# Altium schematic sheet Sheet1asc2.SchDoc
size 594 x 420 mm; SheetNumber: 1; SheetTotal: 1; SPICEModelCacheQNQMALTS: <root>  <DocumentId>QNQMALTS</DocumentId>  <CacheFrame Number="0">    <Model Name="spdtrelay" Kind="CKT">      <Text>*Generic SPDT Relay*Connections:     COM *                 | NC*                 | | NO*                 | | | T1*                 | | | | T2*                 | | | | |.SUBCKT SPDTRELAY 1 2 3 4 5 + PARAMS: PULLIN=4 DROPOFF=0.1 CONTACT=1m RESISTANCE=500 INDUCTANCE=10mL1 4 6 {(INDUCTANCE/2)}L2 5 7 {(INDUCTANCE/2)}R1 6 7 {RESISTANCE}BNO 8 0 V={PULLIN}-abs(v(6,7))SW1 2 1 8 0 SWNC ONBNC 9 0 V=abs(v(6,7))SW2 3 1 9 0 SWNO OFF.MODEL SWNC SW(VT={DROPOFF} RON={CONTACT} ).MODEL SWNO SW(VT={(PULLIN*0.98)} RON={CONTACT} ).ENDS SPDTRELAY</Text>    </Model>    <Model Name="dpstrelay" Kind="CKT">      <Text>*DPST Relay Subcircuit Parameters*PULLIN     = Pull in voltage*DROPOFF    = Drop off voltage*CONTACT    = Contact resistance*RESISTANCE = Coil resistance*INDUCTANCE = Coil Inductance * jjt 15/6/2002: changed DPDT model to DPST.**Generic DPST Relay*Connections:     NO_A1*                 | NO_A2*                 | | NO_B1*                 | | | NO_B2*                 | | | |  T1*                 | | | |  | T2*                 | | | |  | |*                 | | | |  | |*                 | | | |  | |*                 | | | |  | |.SUBCKT DPSTRELAY 1 2 3 10 4 5+ PARAMS: PULLIN=4 DROPOFF=0.1 CONTACT=1m RESISTANCE=500 INDUCTANCE=10mL1 4 6 {(INDUCTANCE/2)}L2 5 7 {(INDUCTANCE/2)}R1 6 7 {RESISTANCE}*BNO1 8 0 V={PULLIN}-abs(v(6,7))SW1 1 2 8 0 SWNO OFF*BNO2 9 0 V={PULLIN}-abs(v(6,7))SW2 3 10 9 0 SWNO OFF*.MODEL SWNO SW(VT={(PULLIN*0.98)} RON={CONTACT} ).ENDS DPSTRELAY</Text>    </Model>    <Model Name="spstrelay" Kind="CKT">      <Text>*SPST Relay Subcircuit Parameters*PULLIN     = Pull in voltage*DROPOFF    = Drop off voltage*CONTACT    = Contact resistance*RESISTANCE = Coil resistance*INDUCTANCE = Coil Inductance * jjt 15/6/2002: changed DPST model to SPST.**Generic DPST Relay*Connections:     NO_A1*                 | NO_A2*                 | | T1*                 | | | T2*                 | | | |*                 | | | |*                 | | | |*                 | | | |.SUBCKT SPSTRELAY 1 2 4 5+ PARAMS: PULLIN=4 DROPOFF=0.1 CONTACT=1m RESISTANCE=500 INDUCTANCE=10mL1 4 6 {(INDUCTANCE/2)}L2 5 7 {(INDUCTANCE/2)}R1 6 7 {RESISTANCE}*BNO1 8 0 V={PULLIN}-abs(v(6,7))SW1 1 2 8 0 SWNO OFF*.MODEL SWNO SW(VT={(PULLIN*0.98)} RON={CONTACT} ).ENDS SPSTRELAY</Text>    </Model>    <Model Name="cap" Kind="MDL">      <Text>*Default semiconductor capacitor.MODEL CAP C()</Text>    </Model>    <Model Name="1n4448" Kind="MDL">      <Text>.model 1N4448  D(Is=0.1p Rs=2 CJO=2p Tt=12n Bv=100 Ibv=0.1p)</Text>    </Model>    <Model Name="1n4148" Kind="MDL">      <Text>.model 1N4148  D(Is=0.1p Rs=16 CJO=2p Tt=12n Bv=100 Ibv=0.1p)</Text>    </Model>  </CacheFrame></root>
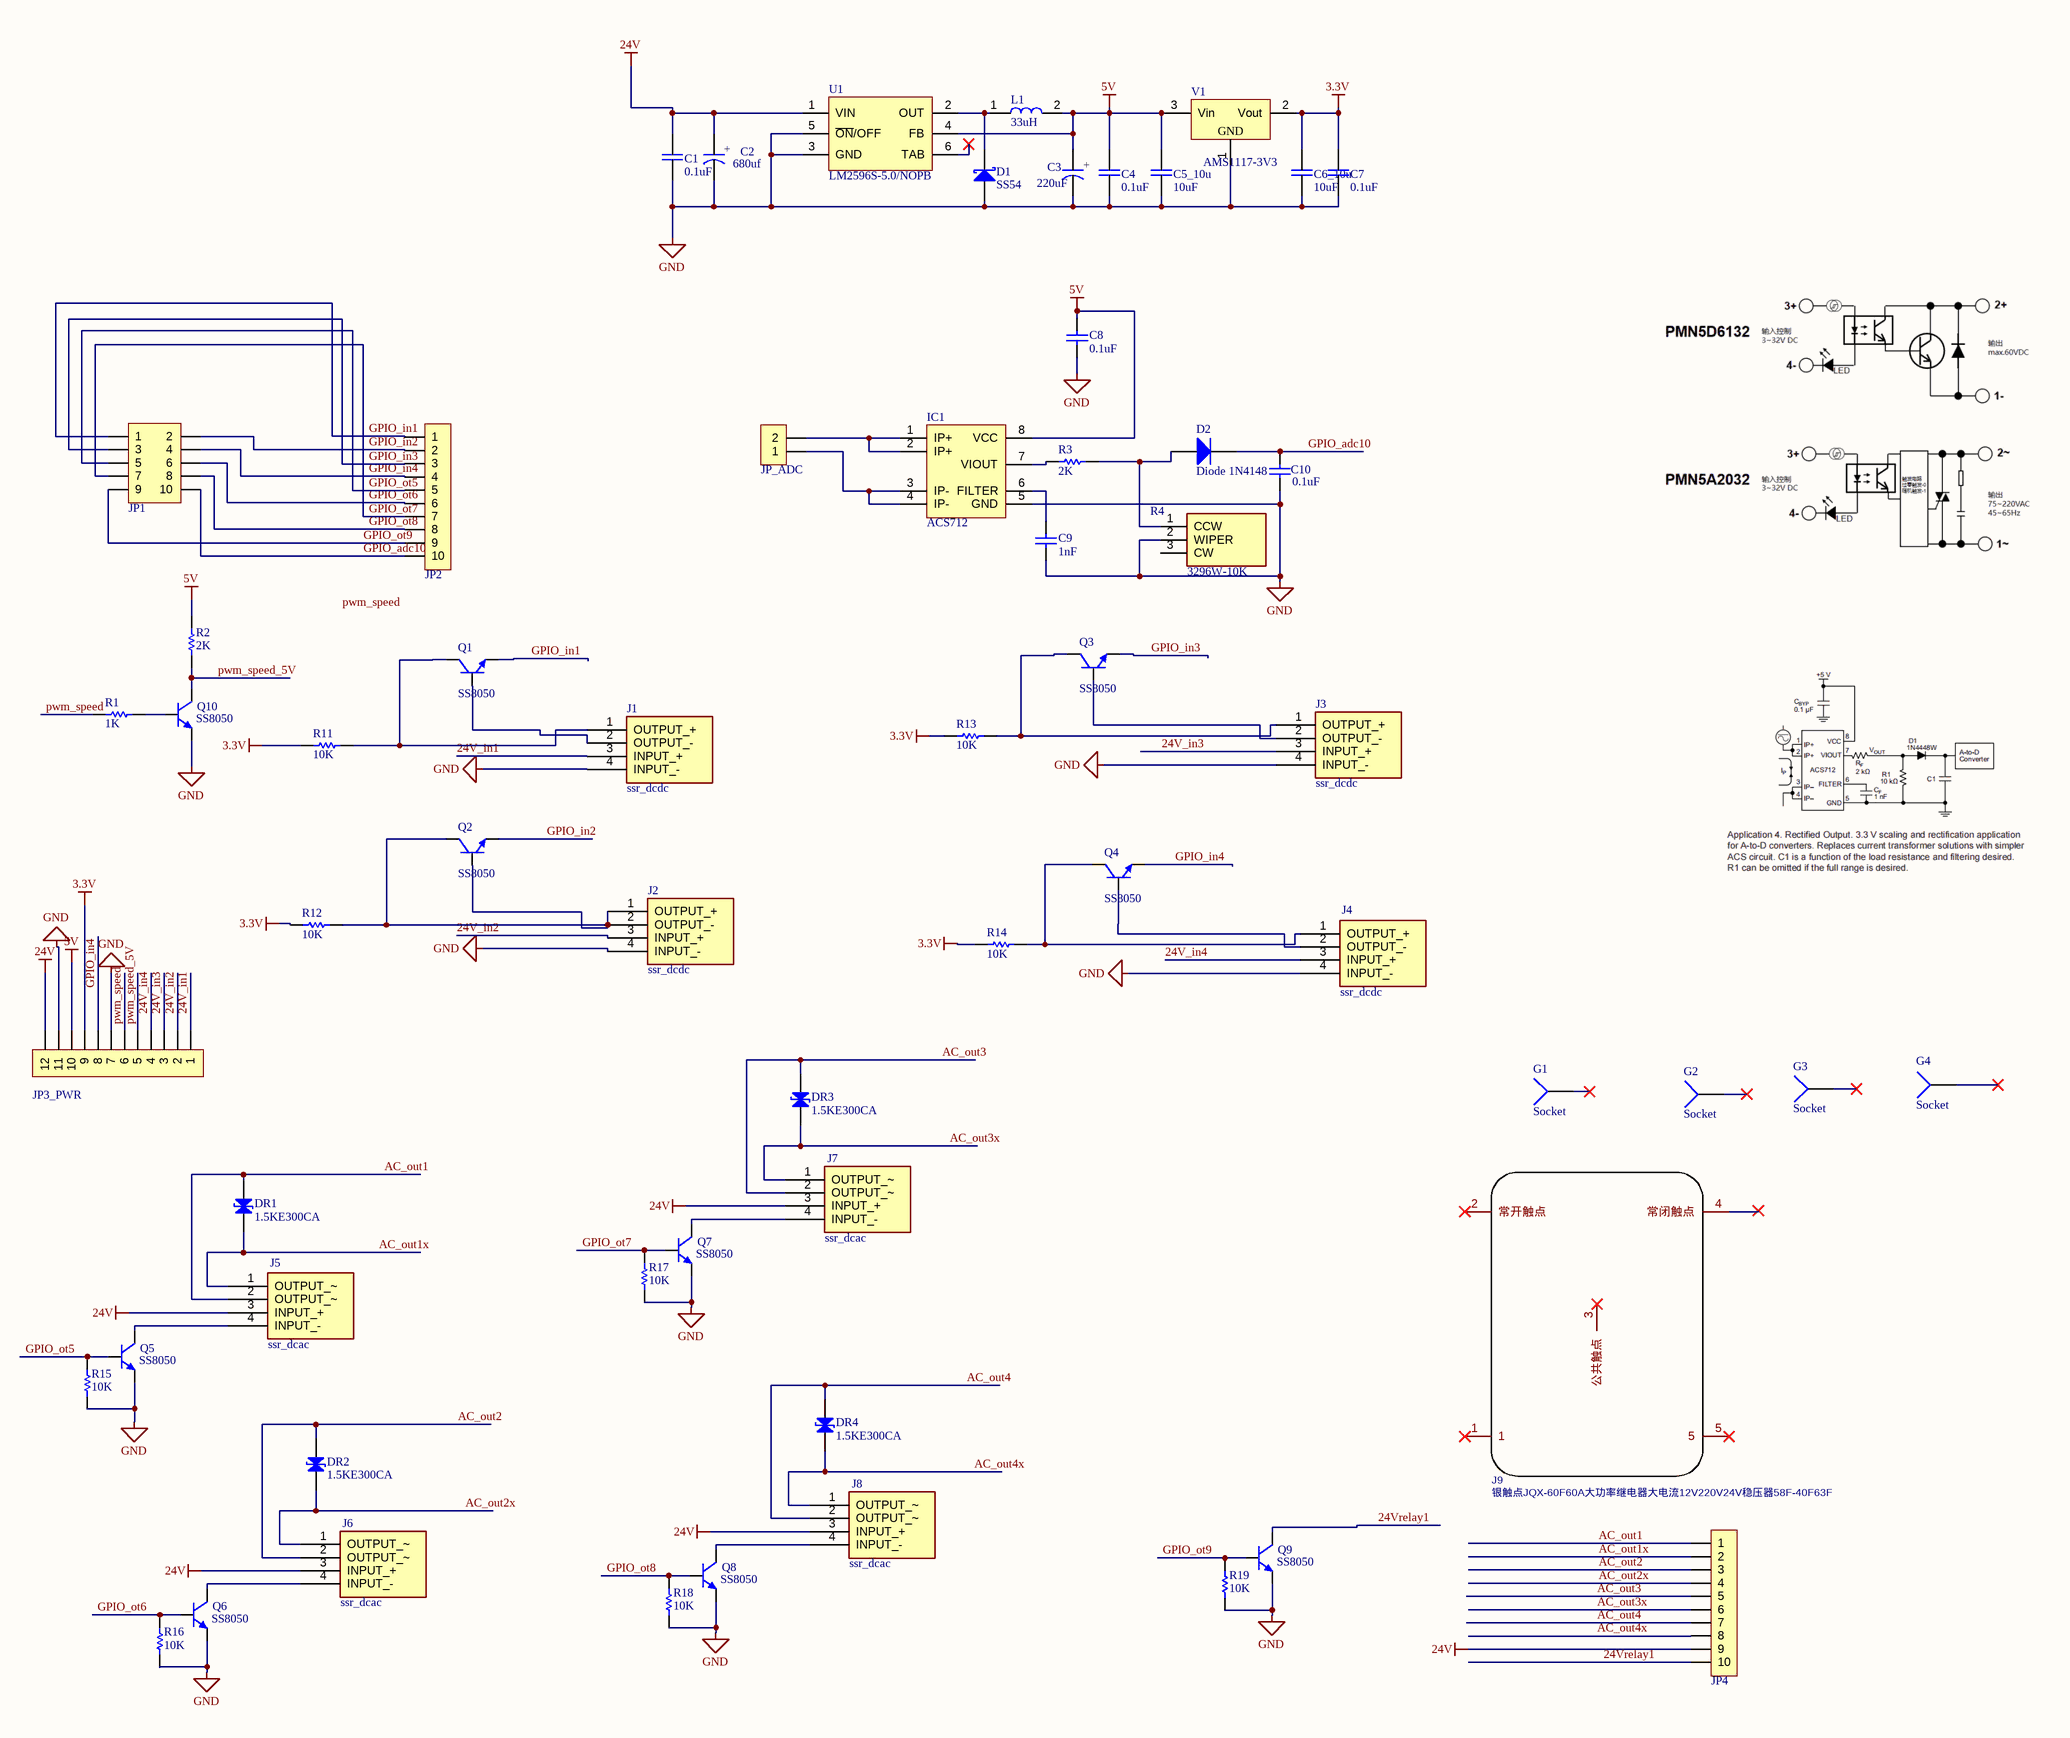
[diagram p0: Sheet1asc2.SchDoc]

## Parts
C1  0.1uF  [C 0805_M]
C2  680uf  [CAP 5.0*12.5*20]
C3  220uF  [CAP 5.0*10*16]
C4  0.1uF  [C 0805_M]
C5_10u  10uF  [C 0805_M]
C6_10u  10uF  [C 0805_M]
C7  0.1uF  [C 0805_M]
C8  0.1uF  [C 0805_M]
C9  1nF  [C 0805_M]
C10  0.1uF  [C 0805_M]
D1  SS54  [SMA]
D2  Diode 1N4148  [SOD-123]
DR1  1.5KE300CA  [SMB_L4.6-W3.6-LS5.3-BI]
DR2  1.5KE300CA  [SMB_L4.6-W3.6-LS5.3-BI]
DR3  1.5KE300CA  [SMB_L4.6-W3.6-LS5.3-BI]
DR4  1.5KE300CA  [SMB_L4.6-W3.6-LS5.3-BI]
G1  Socket  [M3x6_L]
G2  Socket  [M3x6_L]
G3  Socket  [M3x6_L]
G4  Socket  [M3x6_L]
IC1  ACS712  [SOP8_M]
J1  ssr_dcdc  [SSR_DCDC]
J2  ssr_dcdc  [SSR_DCDC]
J3  ssr_dcdc  [SSR_DCDC]
J4  ssr_dcdc  [SSR_DCDC]
J5  ssr_dcac  [SSR_DCAC]
J6  ssr_dcac  [SSR_DCAC]
J7  ssr_dcac  [SSR_DCAC]
J8  ssr_dcac  [SSR_DCAC]
J9  银触点JQX-60F60A大功率继电器大电流12V220V24V稳压器58F-40F63F  [24V_Big_Relay]
JP1  Header 5X2  [IDC2.54-LI-2x5P]  (value not drawn)
JP2  HDR-1X10  [KF128-3.81-10P]  (value not drawn)
JP3_PWR  HDR-1X12  [KF128-3.81-12P]  (value not drawn)
JP4  HDR-1X10  [KF128-3.81-10P]  (value not drawn)
JP_ADC  HDR-1X2  [KF128-3.81-2P]  (value not drawn)
L1  33uH  [CDRH74]
Q1  SS8050  [TO92A]
Q2  SS8050  [TO92A]
Q3  SS8050  [TO92A]
Q4  SS8050  [TO92A]
Q5  SS8050  [TO92A]
Q6  SS8050  [TO92A]
Q7  SS8050  [TO92A]
Q8  SS8050  [TO92A]
Q9  SS8050  [TO92A]
Q10  SS8050  [TO92A]
R1  1K  [R 0805_M]
R2  2K  [R 0805_M]
R3  2K  [R 0805_M]
R4  3296W-10K  [3296W]
R11  10K  [R 0805_M]
R12  10K  [R 0805_M]
R13  10K  [R 0805_M]
R14  10K  [R 0805_M]
R15  10K  [R 0805_M]
R16  10K  [R 0805_M]
R17  10K  [R 0805_M]
R18  10K  [R 0805_M]
R19  10K  [R 0805_M]
U1  LM2596S-5.0/NOPB  [TO263-5A]
V1  AMS1117-3V3  [SOT223_M]

## Nets
3.3V: C6_10u.2 C7.2 JP3_PWR.9 R11.1 R12.1 R13.1 R14.1 V1.2(Vout)
5V: C3.2 C4.2 C5_10u.2 C8.2 IC1.8(VCC) JP3_PWR.10 L1.2 R2.2 U1.4(FB) V1.3(Vin)
24V: C1.2 C2.2 J5.3(INPUT_+) J6.3(INPUT_+) J7.3(INPUT_+) J8.3(INPUT_+) JP3_PWR.12 JP4.9 U1.1(VIN)
GND: C1.1 C2.1 C3.1 C4.1 C5_10u.1 C6_10u.1 C7.1 C8.1 C9.1 C10.1 D1.1 IC1.5(GND) J1.4(INPUT_-) J2.4(INPUT_-) J3.4(INPUT_-) J4.4(INPUT_-) JP3_PWR.7 JP3_PWR.11 Q5.1(E) Q6.1(E) Q7.1(E) Q8.1(E) Q9.1(E) Q10.1(E) R4.2(WIPER) R15.2 R16.2 R17.2 R18.2 R19.2 U1.3(GND) U1.5(~{ON}/OFF) V1.1(GND)
24V_in1: J1.3(INPUT_+) JP3_PWR.1
24V_in2: J2.3(INPUT_+) JP3_PWR.2
24V_in3: J3.3(INPUT_+) JP3_PWR.3
24V_in4: J4.3(INPUT_+) JP3_PWR.4
24Vrelay1: JP4.10 Q9.3(C)
AC_out1: DR1.1(A) J5.2(OUTPUT_~) JP4.1
AC_out1x: DR1.2(K) J5.1(OUTPUT_~) JP4.2
AC_out2: DR2.1(A) J6.2(OUTPUT_~) JP4.3
AC_out2x: DR2.2(K) J6.1(OUTPUT_~) JP4.4
AC_out3: DR3.1(A) J7.2(OUTPUT_~) JP4.5
AC_out3x: DR3.2(K) J7.1(OUTPUT_~) JP4.6
AC_out4: DR4.1(A) J8.2(OUTPUT_~) JP4.7
AC_out4x: DR4.2(K) J8.1(OUTPUT_~) JP4.8
GPIO_adc10: C10.2 D2.2(K) JP1.10 JP2.10
GPIO_in1: JP1.1 JP2.1 Q1.1(E)
GPIO_in2: JP1.2 JP2.2 Q2.1(E)
GPIO_in3: JP1.3 JP2.3 Q3.1(E)
GPIO_in4: JP1.4 JP2.4 JP3_PWR.8 Q4.1(E)
GPIO_ot5: JP1.5 JP2.5 Q5.2(B) R15.1
GPIO_ot6: JP1.6 JP2.6 Q6.2(B) R16.1
GPIO_ot7: JP1.7 JP2.7 Q7.2(B) R17.1
GPIO_ot8: JP1.8 JP2.8 Q8.2(B) R18.1
GPIO_ot9: JP1.9 JP2.9 Q9.2(B) R19.1
pwm_speed: JP3_PWR.6 R1.1
pwm_speed_5V: JP3_PWR.5 Q10.3(C) R2.1
NetC9_2: C9.2 IC1.6(FILTER)
NetD1_2: D1.2 L1.1 U1.2(OUT)
NetD2_1: D2.1(A) R3.2 R4.1(CCW)
NetIC1_1: IC1.1(IP+) IC1.2(IP+) JP_ADC.2
NetIC1_3: IC1.3(IP-) IC1.4(IP-) JP_ADC.1
NetIC1_7: IC1.7(VIOUT) R3.1
NetJ1_1: J1.1(OUTPUT_+) Q1.3(C) R11.2
NetJ1_2: J1.2(OUTPUT_-) Q1.2(B)
NetJ2_1: J2.1(OUTPUT_+) J2.2(OUTPUT_-) Q2.2(B) Q2.3(C) R12.2
NetJ3_1: J3.1(OUTPUT_+) Q3.3(C) R13.2
NetJ3_2: J3.2(OUTPUT_-) Q3.2(B)
NetJ4_1: J4.1(OUTPUT_+) Q4.3(C) R14.2
NetJ4_2: J4.2(OUTPUT_-) Q4.2(B)
NetJ5_4: J5.4(INPUT_-) Q5.3(C)
NetJ6_4: J6.4(INPUT_-) Q6.3(C)
NetJ7_4: J7.4(INPUT_-) Q7.3(C)
NetJ8_4: J8.4(INPUT_-) Q8.3(C)
NetQ10_2: Q10.2(B) R1.2

Not connected (* = marked no-connect by the designer): G1 1*; G2 1*; G3 1*; G4 1*; J9 1* 2(常开触点)* 3(公共触点)* 4(常闭触点)* 5*; R4 3(CW); U1 6(TAB)*

## Notes on the sheet
- Labels drawn without touching a wire or pin: pwm_speed
- DWG NO:
- REV:
- THIS DOCUMENT AND THE DATA DISCLOSED HEREIN OR
- HEREWITH IS THE PROPERTY OF ALTIUM LIMITED AND MAY
- BE FREELY DISTRIBUTED IN WHOLE. NO RIGHTS ARE
- RESERVED OR EXPRESS OR IMPLIED WARANTEE GIVEN.
- REVISION
- DESCRIPTION
- DATE
- APPROVED
- ENG:
- APPROVALS
- PROJECT
- DSN:
- CHK:
- REFERENCE DOCUMENTS
- PROJECT REVISION:
- TITLE
- DOCUMENT REVISION:
- DESIGN ITEM:
- BOM:
- FAB DWG:
- PCB DWG:
- ASSY DWG:
- SCALE:
- A2
- SIZE
- CAGE CODE
- FILE NAME
- DWG NO.
- SHEET
- OF
- REV
- (in symbol CAP-SMD) +

## Library data of the parts
C1 C4 C5_10u C6_10u C7 = CAP-SMT
C2 C3 = CAP-SMD: Supplier 1: Arrow Electronics
C8-C10 = Cap: Capacitor; Published: 8-Jun-2000; LatestRevisionDate: 17-Jul-2002; LatestRevisionNote: Re-released for DXP Platform.; PackageReference: RAD-0.3; Publisher: Altium Limited; PackageDescription: Radial Cap, Thru-Hole; 2 Leads; 0.3 in Pin Spacing
D1 = DIO
D2 = Diode 1N4148: High Conductance Fast Diode; Published: 8-Jun-2000; LatestRevisionDate: 17-Jul-2002; LatestRevisionNote: Re-released for DXP Platform.; DatasheetVersion: 1997; PackageReference: DO-35; Publisher: Altium Limited; PackageDescription: Diode, Axial; Body 3.8 x 1.9 mm (LxDia. max), Lead Dia. 0.53 mm (max); Code_JEDEC: DO-204-AH; ComponentLink1Description: Manufacturer Link; ComponentLink1URL: http://www.fairchildsemi.com/; ComponentLink2Description: Datasheet; ComponentLink2URL: http://www.fairchildsemi.com/ds/1N%2F1N4148.pdf
DR1-DR4 = DR: 瞬态电压抑制二极管; 版权归属: 源创客; BOM名称: 瞬态电压抑制二极管; 学习资源: www.ooocke.com
IC1 = ACS712: 电流检测芯片; 版权归属: 源创客; BOM名称: 电流检测芯片; 学习资源: www.ooocke.com
J1-J4 = ssr_dcdc: Connector; Manufacturer_Name: Phoenix Contact; Manufacturer_Part_Number: 2982647; Datasheet Link: https://componentsearchengine.com/Datasheets/1/2982647.pdf; Height: 25.4mm; Mouser Part Number: 651-2982647; Mouser Price/Stock: https://www.mouser.co.uk/ProductDetail/Phoenix-Contact/2982647?qs=Mj9TL1%2FHg907%2FKjSTtcRdw%3D%3D; Arrow Part Number: 2982647; Arrow Price/Stock: https://www.arrow.com/en/products/2982647/phoenix-contact
J5-J8 = ssr_dcac: Connector; Manufacturer_Name: Phoenix Contact; Manufacturer_Part_Number: 2982647; Datasheet Link: https://componentsearchengine.com/Datasheets/1/2982647.pdf; Height: 25.4mm; Mouser Part Number: 651-2982647; Mouser Price/Stock: https://www.mouser.co.uk/ProductDetail/Phoenix-Contact/2982647?qs=Mj9TL1%2FHg907%2FKjSTtcRdw%3D%3D; Arrow Part Number: 2982647; Arrow Price/Stock: https://www.arrow.com/en/products/2982647/phoenix-contact
J9 = 银触点JQX-60F60A大功率继电器大电流12V220V24V稳压器58F-40F63F: Contributor: locolyl; spicePre: U; spiceSymbolName: 银触点JQX-60F60A大功率继电器大电流12V220V24V稳压器58F-40F63F
JP1 = Header 5X2: 5*2P接插件; 版权归属: 源创客; BOM名称: 5*2P接插件; 学习资源: www.ooocke.com
JP2 JP4 = Header 10: 10P接插件; 版权归属: 源创客; BOM名称: 10P接插件; 学习资源: www.ooocke.com
JP3_PWR = Header 12: 12P接插件; 版权归属: 源创客; BOM名称: 12P接插件; 学习资源: www.ooocke.com
JP_ADC = Header 2: 2P接插件; 版权归属: 源创客; BOM名称: 2P接插件; 学习资源: www.ooocke.com
L1 = L-CDRH74
Q1-Q10 = 8050-DIP: 高频放大-NPN型; 版权归属: 源创客; 属性: 40V 1.5A 1W 100MHZ; BOM名称: 高频放大-NPN型; 学习资源: www.ooocke.com
R1-R3 R11-R19 = Res1: Resistor; Published: 8-Jun-2000; LatestRevisionDate: 17-Jul-2002; LatestRevisionNote: Re-released for DXP Platform.; PackageReference: AXIAL-0.3; Publisher: Altium Limited; PackageDescription: Axial Device, Thru-Hole; 2 Leads; 0.3 in Pin Spacing
R4 = 3296W-1-100LF: Resistor; Manufacturer_Name: Bourns; Datasheet Link: http://uk.rs-online.com/web/p/products/5219619; Manufacturer_Part_Number: 3296W-1-100LF; Mouser Part Number: 652-3296W-1-100LF; Mouser Price/Stock: https://www.mouser.co.uk/ProductDetail/Bourns/3296W-1-100LF?qs=QXsCy0sQn1AEVjRqsT9BNA%3D%3D; Arrow Part Number: 3296W-1-100LF; Arrow Price/Stock: https://www.arrow.com/en/products/3296w-1-100lf/bourns
U1 = LM2596S-5.0: SIMPLE SWITCHER® Power Converter 150 KHz 3A Step-Down Voltage Regulator, 5-pin TO-263, Pb-Free; Manufacturer: Texas Instruments; PowerWise: N; PackageTopMarking: NSUZXYTTE#*LM2596S*-5.0 P+; ComponentLink1URL: http://www.ti.com/general/docs/lit/getliterature.tsp?genericPartNumber=LM2596&fileType=pdf; PackageDescription: TO-263, Molded, .400 x .390 x .180in, 5 Lead, .067in Pitch, Surface Mount; RoHS: Y; PinCount: 5; Code_JEDEC: MO-169-AB; ComponentLink1Description: Datasheet URL; PackageReference: KTT0005B; CompType: Switcher
V1 = AMS1117: 三端稳压芯片; BOM名称: 稳压芯片; 版权归属: 源创客; 学习资源: www.ooocke.com
G1-G4 = Socket: LatestRevisionDate: 17-Jul-2002; LatestRevisionNote: Re-released for DXP Platform.; Publisher: Altium Limited